# EAGLE design h-bridge2-draft2 (EAGLE 6.5.0)
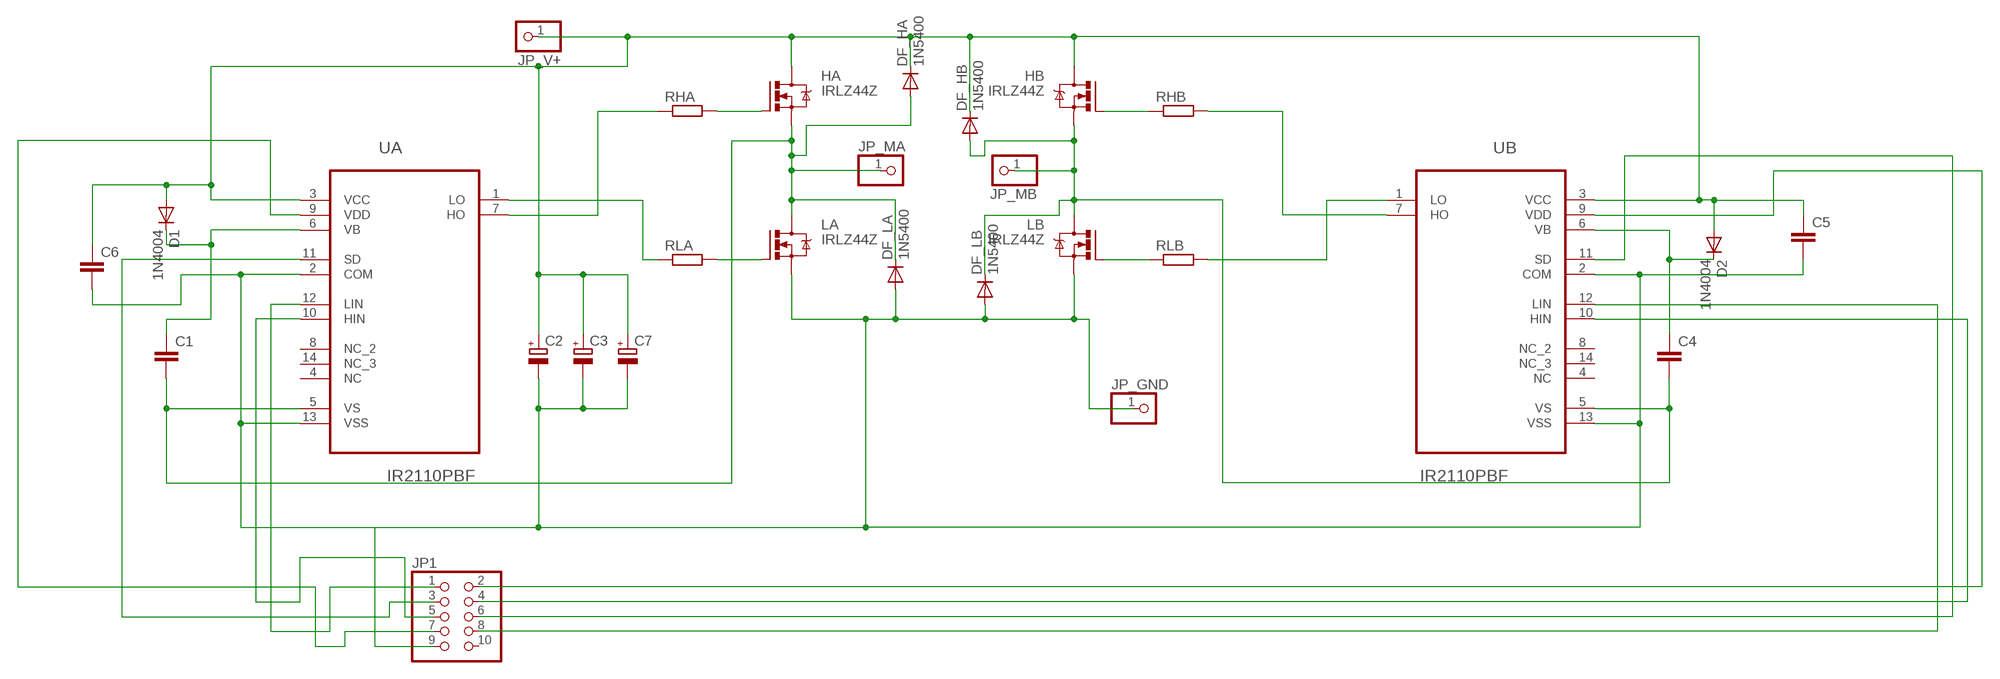
[diagram p0: schematic, sheet 1]

## Parts
C1  C-EU025-025X050  [C025-025X050]
C2  CPOL-EUE5-13  [E5-13]
C3  CPOL-EUE5-13  [E5-13]
C4  C-EU025-025X050  [C025-025X050]
C5  C-EU025-025X050  [C025-025X050]
C6  C-EU025-025X050  [C025-025X050]
C7  CPOL-EUE5-13  [E5-13]
D1  1N4004  [DO41-10]
D2  1N4004  [DO41-10]
DF_HA  1N5400  [DO201-15]
DF_HB  1N5400  [DO201-15]
DF_LA  1N5400  [DO201-15]
DF_LB  1N5400  [DO201-15]
HA  IRLZ44Z  [TO220BH]
HB  IRLZ44Z  [TO220BH]
JP1  PINHD-2X5  [2X05]
JP_GND  PINHD-1X1  [1X01]
JP_MA  PINHD-1X1  [1X01]
JP_MB  PINHD-1X1  [1X01]
JP_V+  PINHD-1X1  [1X01]
LA  IRLZ44Z  [TO220BH]
LB  IRLZ44Z  [TO220BH]
RHA  R-EU_0411/15  [0411/15]
RHB  R-EU_0411/15  [0411/15]
RLA  R-EU_0411/15  [0411/15]
RLB  R-EU_0411/15  [0411/15]
UA  IR2110PBF  [DIP254P762X533-14]
UB  IR2110PBF  [DIP254P762X533-14]

## Nets
N$4: C2.- C3.- C5.2 C6.2 C7.- DF_LA.A DF_LB.A JP1.9 JP_GND.1 LA.S LB.S UA.2(COM) UA.13(VSS) UB.2(COM) UB.13(VSS)
N$5: LA.G RLA.2
N$6: HA.G RHA.2
N$7: HB.G RHB.1
N$8: LB.G RLB.1
N$9: RHA.1 UA.7(HO)
N$10: RLA.1 UA.1(LO)
N$11: RHB.2 UB.7(HO)
N$12: RLB.2 UB.1(LO)
N$13: C2.+ C3.+ C5.1 C6.1 C7.+ D1.A D2.A DF_HA.C DF_HB.C HA.D HB.D JP_V+.1 UA.3(VCC) UB.3(VCC)
N$14: C1.1 D1.C UA.6(VB)
N$16: C4.2 DF_HB.A DF_LB.C HB.S JP_MB.1 LB.D UB.5(VS)
N$17: C1.2 DF_HA.A DF_LA.C HA.S JP_MA.1 LA.D UA.5(VS)
N$18: C4.1 D2.C UB.6(VB)
N$20: JP1.3 UA.11(SD)
N$22: JP1.7 UA.9(VDD)
N$23: JP1.5 UA.10(HIN)
N$24: JP1.1 UA.12(LIN)
N$25: JP1.2 UB.9(VDD)
N$26: JP1.4 UB.10(HIN)
N$27: JP1.6 UB.11(SD)
N$28: JP1.8 UB.12(LIN)
Unconnected: JP1.10 UA.4(NC) UA.8(NC_2) UA.14(NC_3) UB.4(NC) UB.8(NC_2) UB.14(NC_3)

## Library data of the parts
C1 C4-C6 = rcl:C-EU: CAPACITOR, European symbol
C2 C3 C7 = rcl:CPOL-EU: POLARIZED CAPACITOR, European symbol
D1 D2 = diode:1N4004: DIODE general purpose rectifier, 1 A
DF_HA DF_HB DF_LA DF_LB = dbg-misc:1N5400: DIODE standard rectifier, 3 A, 50 V (Motorola)
HA HB LA LB = transistor-power:IRLZ44Z: N-Channel HEXFET® Power MOSFET Logic Level AUTOMOTIVE MOSFET Source: http://www.irf.com/product-info/datasheets/data/irlz44zpbf.pdf
JP1 = pinhead:PINHD-2X5: PIN HEADER
JP_GND JP_MA JP_MB JP_V+ = dbg-misc:PINHD-1X1: PIN HEADER
RHA RHB RLA RLB = rcl:R-EU_: RESISTOR, European symbol
UA UB = ir2110:IR2110PBF: HIGH AND LOW SIDE DRIVER; MPN: IR2110PBF; OC_FARNELL: 8638837; OC_NEWARK: 63J7859; PACKAGE: PDIP-14; SUPPLIER: INTERNATIONAL RECTIFIER

## Board
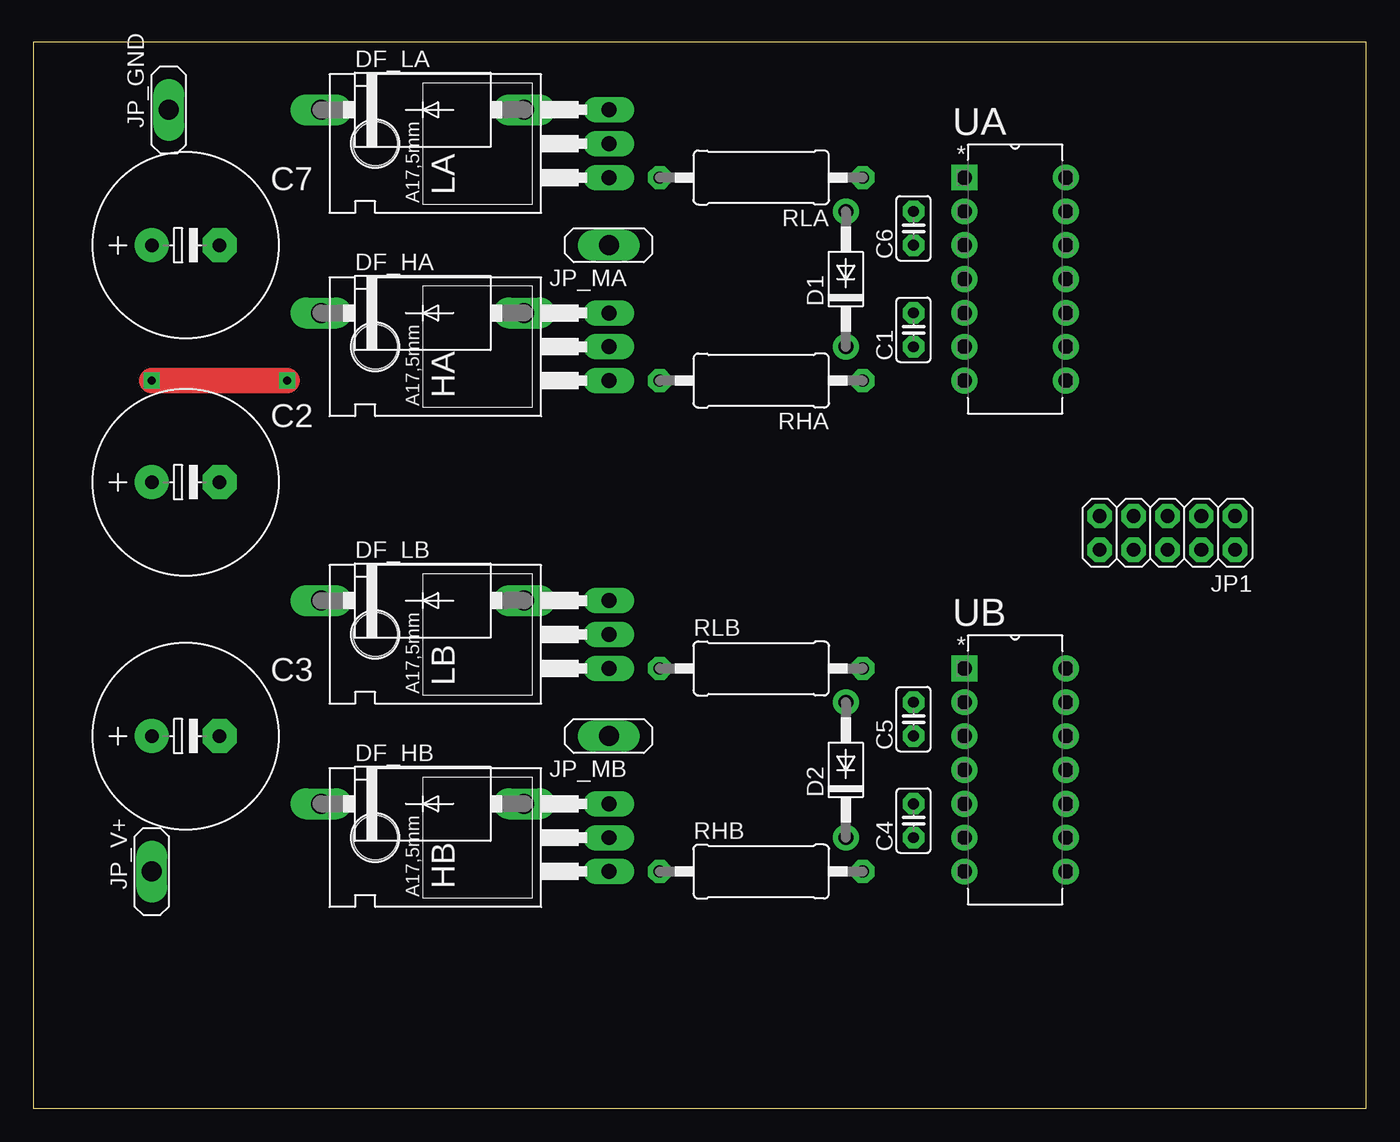
[diagram p1: board, top side]
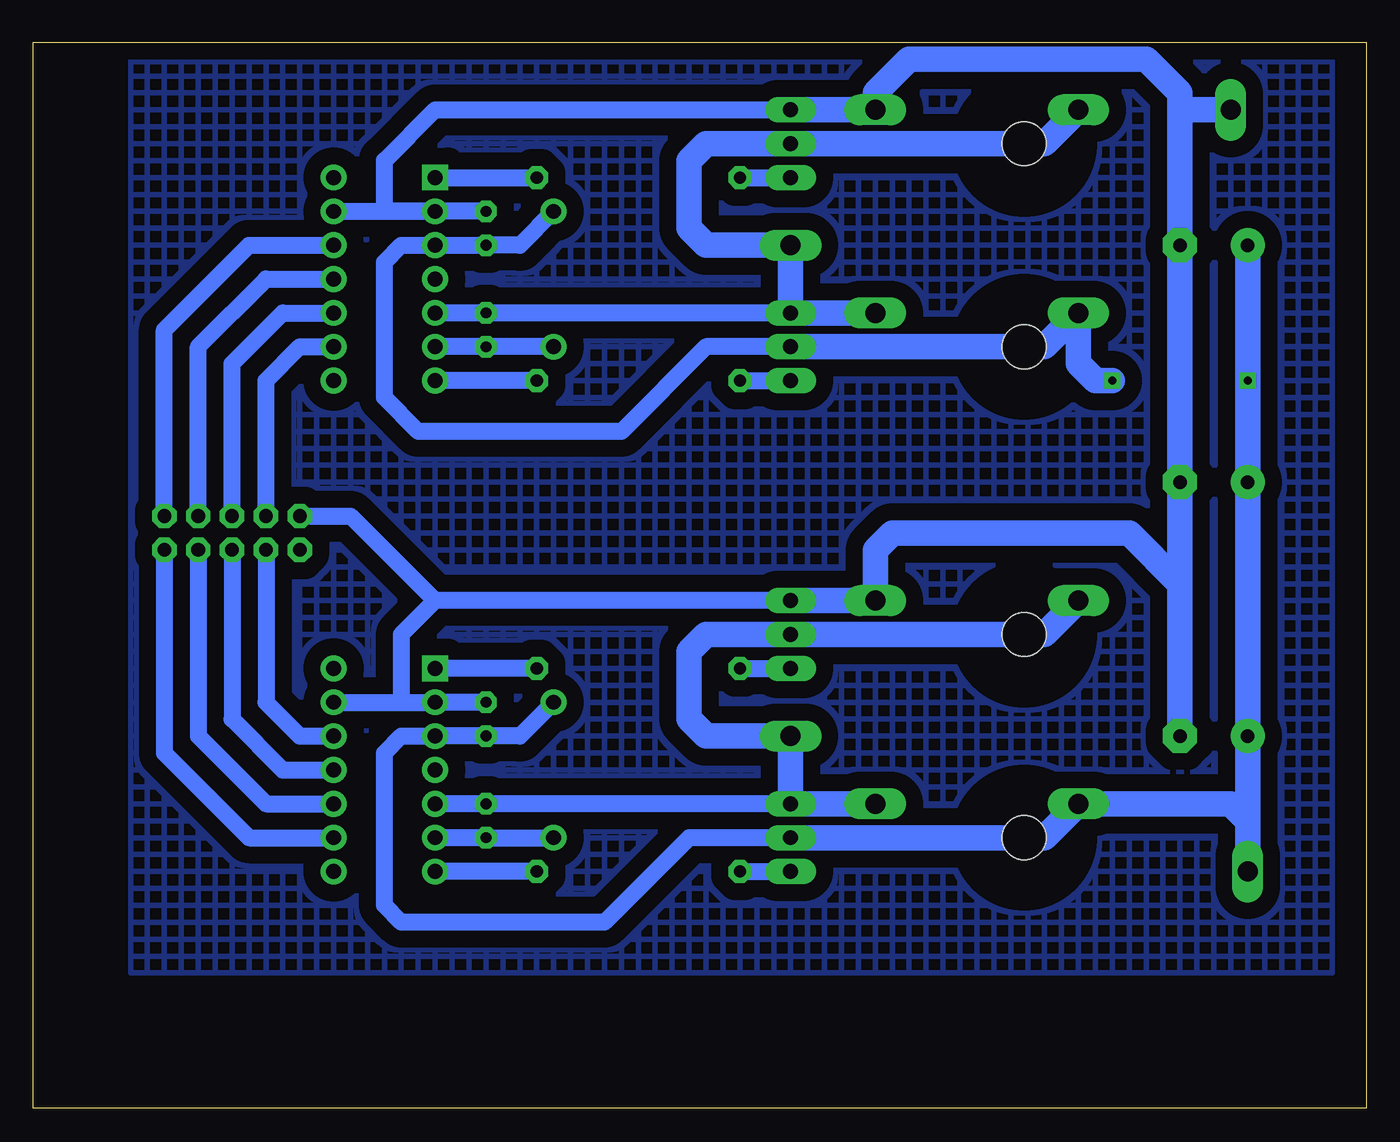
[diagram p2: board, bottom side, seen from below]

Size 100 x 80 mm. Coordinates in mm from the lower left corner, seen from the top.
Outline: 0,0 100,0 100,80 0,80 0,0
Copper layers (1*16): Top 0.035mm / dielectric 1.5mm / Bottom 0.035mm
Design rules "default *": minimum track width 10mil, minimum drill 32mil, track to track 16mil, track to pad 16mil, pad to pad 16mil, via to via 16mil, smd to smd 12mil, copper to edge 40mil, drill to drill 40mil, minimum pad ring 16mil, minimum via ring 12mil, stop-mask expansion 4mil, vias tented up to drill 0mil, thermal gap 10mil

### Footprints (pad centres in the part's own frame; a part is rotated, then mirrored left to right if it is on the bottom)
C025-025X050 = drill 0.813 octagon: 1 -1.27,0; 2 1.27,0
E5-13 = drill 1.016 pad 2.54: + -2.54,0 | drill 1.016 pad 2.54 octagon: - 2.54,0
DO41-10 = drill 1.118: A 5.08,0; C -5.08,0
DO201-15 = drill 1.499 long: A 7.62,0; C -7.62,0
TO220BH = drill 1.118 long: D 0,-6.35; G -2.54,-6.35; S 2.54,-6.35 | hole 3.302: 0,11.176
2X05 = drill 1.016 octagon: 1 -5.08,-1.27; 2 -5.08,1.27; 3 -2.54,-1.27; 4 -2.54,1.27; 5 0,-1.27; 6 0,1.27; 7 2.54,-1.27; 8 2.54,1.27; 9 5.08,-1.27; 10 5.08,1.27
1X01 = drill 1.5 long: 1 0,0
0411/15 = drill 0.914 octagon: 1 -7.62,0; 2 7.62,0
DIP254P762X533-14 = drill 1.118 square: 1 -7.62,15.24 | drill 1.118: 2 -7.62,12.7; 3 -7.62,10.16; 4 -7.62,7.62; 5 -7.62,5.08; 6 -7.62,2.54; 7 -7.62,0; 8 0,0; 9 0,2.54; 10 0,5.08; 11 0,7.62; 12 0,10.16; 13 0,12.7; 14 0,15.24

### Placement (x,y rotation side)
C1  66.04,58.42 90 top
C2  11.43,46.99 0 top
C3  11.43,27.94 0 top
C4  66.04,21.59 90 top
C5  66.04,29.21 90 top
C6  66.04,66.04 90 top
C7  11.43,64.77 0 top
D1  60.96,62.23 90 top
D2  60.96,25.4 90 top
DF_HA  29.21,59.69 0 top
DF_HB  29.21,22.86 0 top
DF_LA  29.21,74.93 0 top
DF_LB  29.21,38.1 0 top
HA  36.83,57.15 90 top
HB  36.83,20.32 90 top
JP1  85.09,43.18 180 top
JP_GND  10.16,74.93 90 top
JP_MA  43.18,64.77 180 top
JP_MB  43.18,27.94 180 top
JP_V+  8.89,17.78 90 top
LA  36.83,72.39 90 top
LB  36.83,35.56 90 top
RHA  54.61,54.61 180 top
RHB  54.61,17.78 0 top
RLA  54.61,69.85 180 top
RLB  54.61,33.02 0 top
UA  77.47,54.61 0 top
UB  77.47,17.78 0 top

### Tracks (layer width: path | path; a pad name or v marks a point on that pad's centre or on a via)
N$1
  pour Bottom (isolate 1.27, hatched): 2.54,80.01 2.54,10.16 92.71,10.16 92.71,80.01
N$4
  Bottom 1.27: C5.2 UB.2 | C6.2 UA.2 | LB.S 69.85,38.1 | 69.85,38.1 72.39,35.56 72.39,30.48 UB.2 | UB.13 UB.2 | UA.2 73.66,67.31 73.66,71.12 69.85,74.93 LA.S | UA.13 UA.2 | JP1.9 76.2,44.45 69.85,38.1
  Bottom 1.93: LA.S DF_LA.A 36.83,76.2 34.29,78.74 16.51,78.74 13.97,76.2 13.97,74.93 | LB.S DF_LB.A 36.83,41.91 35.56,43.18 17.78,43.18 13.97,39.37 | 13.97,39.37 C2.- C7.- 13.97,74.93 | 13.97,39.37 C3.- | JP_GND.1 13.97,74.93
N$5
  Bottom 1.27: RLA.2 LA.G
N$6
  Bottom 1.27: RHA.2 HA.G
N$7
  Bottom 1.27: RHB.1 HB.G
N$8
  Bottom 1.27: RLB.1 LB.G
N$9
  Bottom 1.27: RHA.1 UA.7
N$10
  Bottom 1.27: UA.1 RLA.1
N$11
  Bottom 1.27: RHB.2 UB.7
N$12
  Bottom 1.27: RLB.2 UB.1
N$13  (via drill 0.6)
  Top 1.93: v8.89,54.61 v19.05,54.61
  Bottom 1.27: D2.A 63.5,27.94 C5.1 UB.3 72.39,27.94 73.66,26.67 73.66,15.24 72.39,13.97 57.15,13.97 50.8,20.32 HB.D | D1.A 63.5,64.77 C6.1 UA.3 72.39,64.77 73.66,63.5 73.66,53.34 71.12,50.8 55.88,50.8 49.53,57.15 HA.D
  Bottom 1.93: HA.D 24.13,57.15 DF_HA.C 21.59,55.88 20.32,54.61 v19.05,54.61 | HB.D 24.13,20.32 DF_HB.C 10.16,22.86 8.89,21.59 JP_V+.1 | C7.+ v8.89,54.61 C2.+ C3.+ JP_V+.1 | 8.89,16.51 JP_V+.1
N$14
  Bottom 1.27: UA.6 C1.1 D1.C
N$16
  Bottom 1.27: UB.5 C4.2 HB.S
  Bottom 1.93: DF_HB.A HB.S JP_MB.1 49.53,27.94 50.8,29.21 50.8,34.29 49.53,35.56 LB.D 24.13,35.56 DF_LB.C
N$17
  Bottom 1.27: UA.5 C1.2 HA.S
  Bottom 1.93: DF_HA.A HA.S JP_MA.1 49.53,64.77 50.8,66.04 50.8,71.12 49.53,72.39 LA.D 24.13,72.39 DF_LA.C
N$18
  Bottom 1.27: UB.6 C4.1 D2.C
N$20
  Bottom 1.27: JP1.3 87.63,57.15 82.55,62.23 UA.11
N$22
  Bottom 1.27: JP1.7 82.55,54.61 80.01,57.15 UA.9
N$23
  Bottom 1.27: JP1.5 85.09,55.88 81.28,59.69 UA.10
N$24
  Bottom 1.27: JP1.1 90.17,58.42 83.82,64.77 UA.12
N$25
  Bottom 1.27: JP1.2 90.17,26.67 83.82,20.32 UB.9
N$26
  Bottom 1.27: JP1.4 87.63,27.94 82.55,22.86 UB.10
N$27
  Bottom 1.27: JP1.6 85.09,29.21 81.28,25.4 UB.11
N$28
  Bottom 1.27: JP1.8 82.55,30.48 80.01,27.94 UB.12